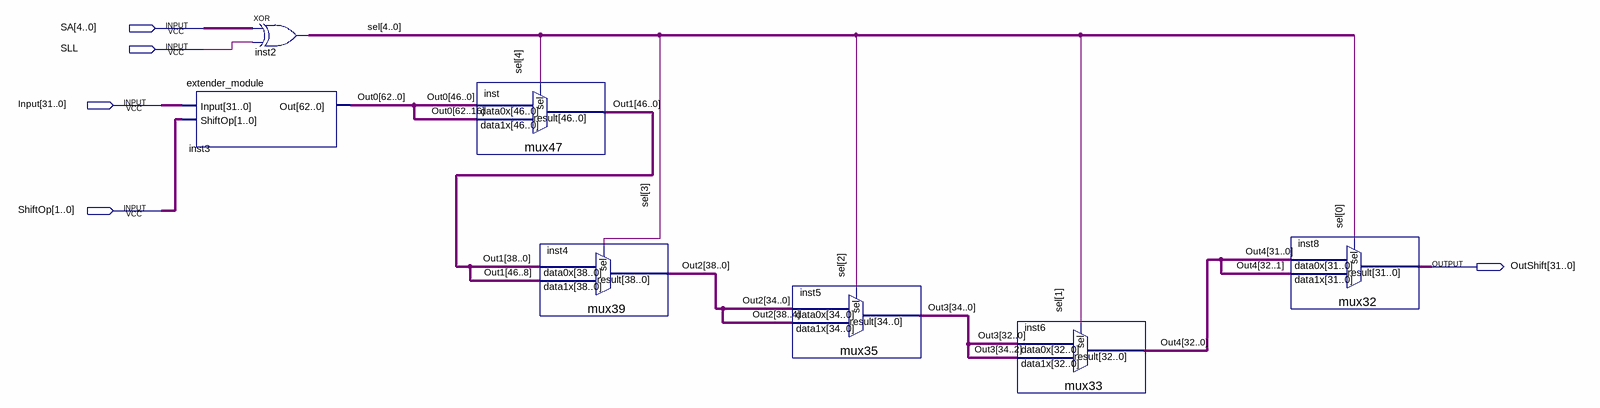
[diagram p0: schematic sheet]
// Quartus schematic Shifter.bdf as structural Verilog: 7 symbols, 5 pins
module Shifter (
  input  [4:0] SA,
  input  SLL,
  input  [31:0] Input,
  input  [1:0] ShiftOp,
  output [31:0] OutShift
);

  wire [4:0] sel;
  wire [32:0] Out4;
  wire [34:0] Out3;
  wire [38:0] Out2;
  wire [46:0] Out1;
  wire [62:0] Out0;

  extender_module inst3 (.Input(Input), .ShiftOp(ShiftOp), .Out(Out0));
  assign sel = SA ^ {5{SLL}};  // XOR inst2, 5 bits wide
  mux47 inst (.data1x(Out0[62:16]), .data0x(Out0[46:0]), .sel(sel[4]), .result(Out1));
  mux39 inst4 (.data1x(Out1[46:8]), .data0x(Out1[38:0]), .sel(sel[3]), .result(Out2));
  mux35 inst5 (.data1x(Out2[38:4]), .data0x(Out2[34:0]), .sel(sel[2]), .result(Out3));
  mux33 inst6 (.data1x(Out3[34:2]), .data0x(Out3[32:0]), .sel(sel[1]), .result(Out4));
  mux32 inst8 (.data1x(Out4[32:1]), .data0x(Out4[31:0]), .sel(sel[0]), .result(OutShift));
endmodule
